# EAGLE schematic oresat-imu (EAGLE 6.6.0)
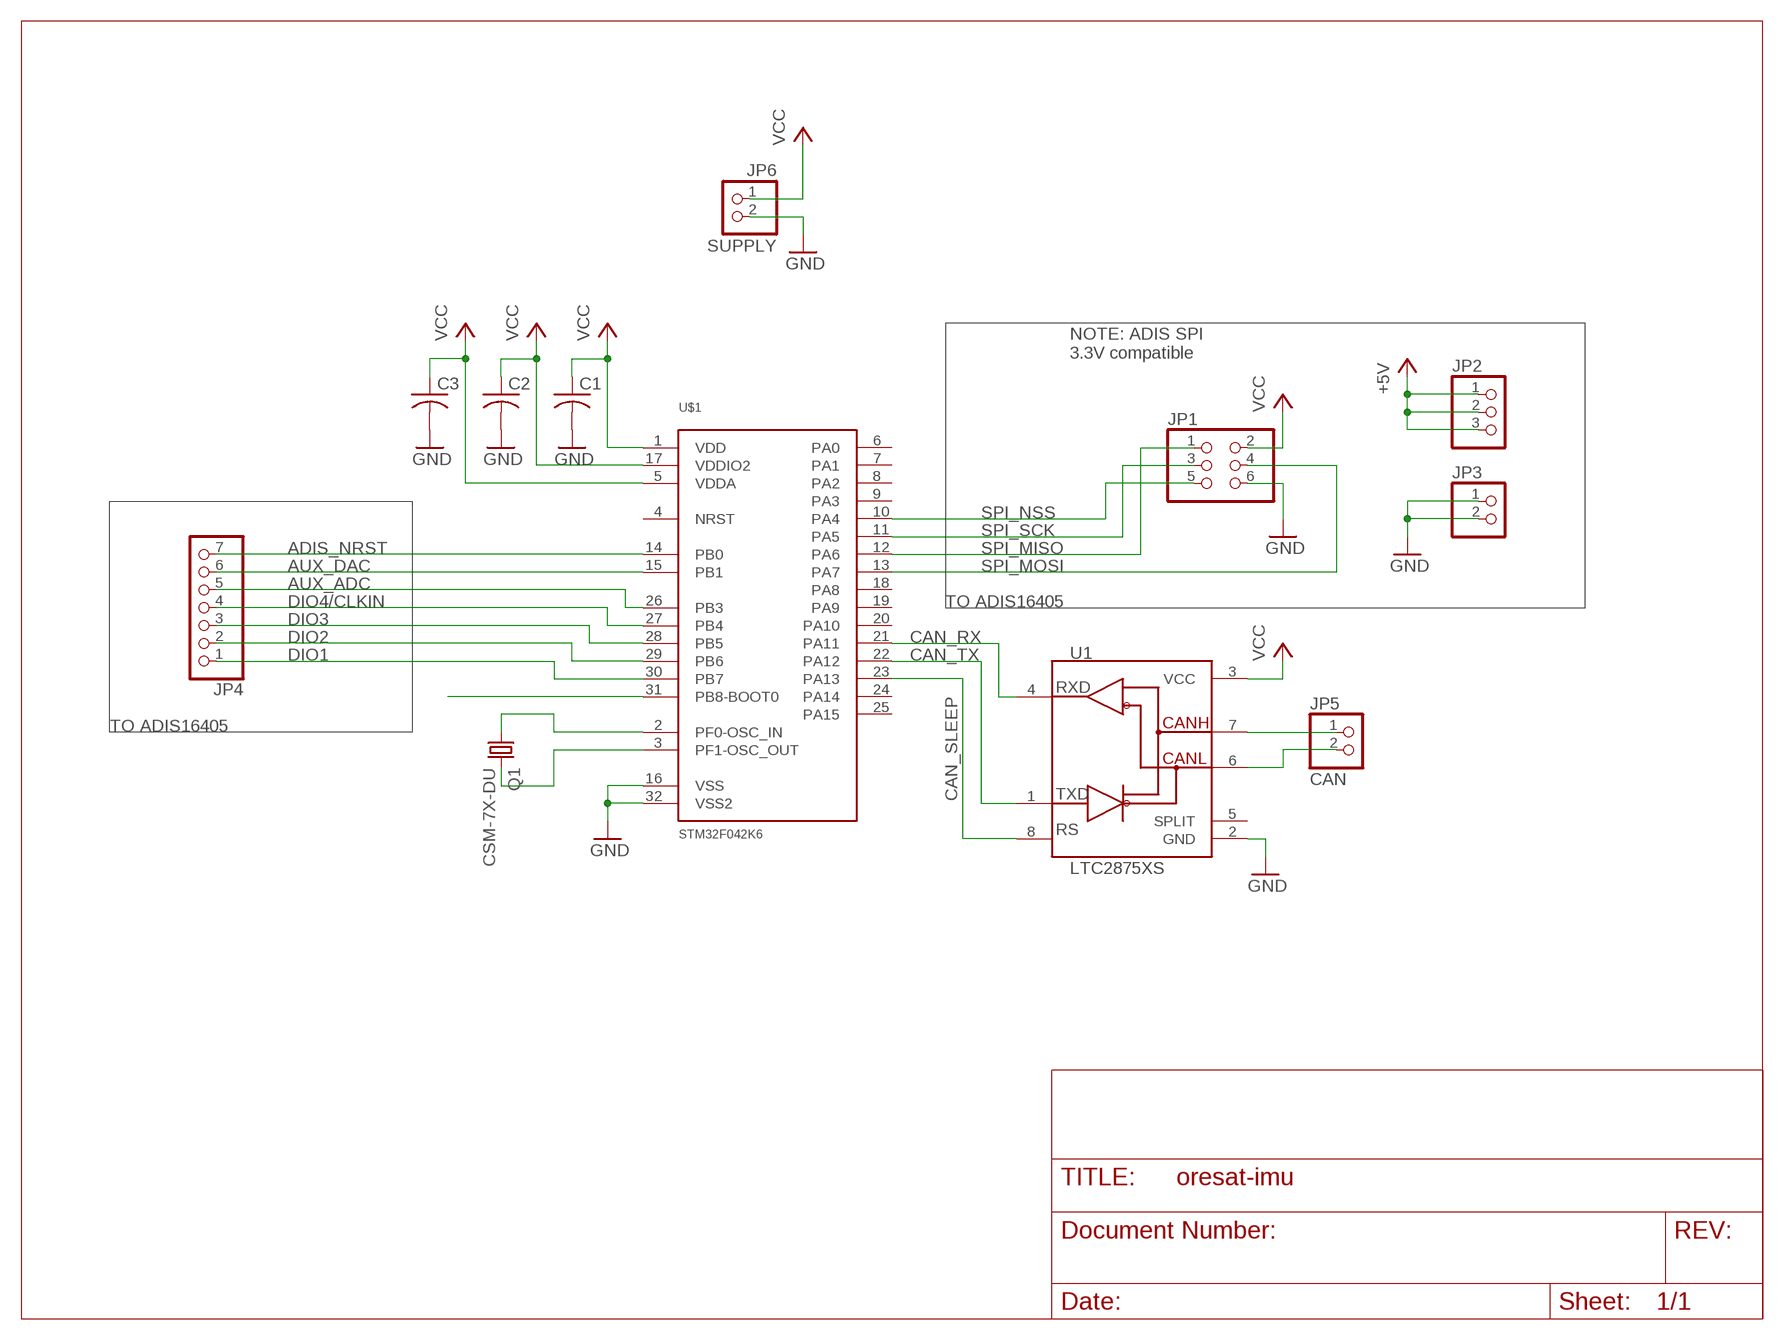
[diagram p0: schematic, sheet 1]

## Parts
C1  C-USC0805  [C0805]
C2  C-USC0805  [C0805]
C3  C-USC0805  [C0805]
JP1  PINHD-2X3  [2X03]
JP2  PINHD-1X3  [1X03]
JP3  PINHD-1X2  [1X02]
JP4  PINHD-1X7  [1X07]
JP5  CAN  PINHD-1X2  [1X02]
JP6  SUPPLY  PINHD-1X2/90  [1X02/90]
Q1  CSM-7X-DU  [CSM-7X-DU]
U1  LTC2875XS  [SO-08]
U$1  STM32F042K6  [LQFP32-7X7]

## Nets
+5V: JP2.1 JP2.2 JP2.3
ADIS_NRST: JP4.7 U$1.14(PB0)
AUX_ADC: JP4.5 U$1.26(PB3)
AUX_DAC: JP4.6 U$1.15(PB1)
CAN_RX: U1.4(RXD) U$1.21(PA11)
CAN_SLEEP: U1.8(RS1) U$1.23(PA13)
CAN_TX: U1.1(TXD) U$1.22(PA12)
CANH: JP5.1 U1.7(CANH)
CANL: JP5.2 U1.6(CANL)
DIO1: JP4.1 U$1.30(PB7)
DIO2: JP4.2 U$1.29(PB6)
DIO3: JP4.3 U$1.28(PB5)
DIO4/CLKIN: JP4.4 U$1.27(PB4)
GND: C1.2 C2.2 C3.2 JP1.6 JP3.1 JP3.2 JP6.2 U1.2(GND) U$1.16(VSS) U$1.32(VSS2)
N$8: Q1.1 U$1.2(PF0-OSC_IN)
N$9: Q1.2 U$1.3(PF1-OSC_OUT)
N$10: U$1.31(PB8-BOOT0)
SPI_MISO: JP1.1 U$1.12(PA6)
SPI_MOSI: JP1.4 U$1.13(PA7)
SPI_NSS: JP1.5 U$1.10(PA4)
SPI_SCK: JP1.3 U$1.11(PA5)
VCC: C1.1 C2.1 C3.1 JP1.2 JP6.1 U1.3(VCC) U$1.1(VDD) U$1.5(VDDA) U$1.17(VDDIO2)
Unconnected: U1.5(SPLIT) U$1.4(NRST) U$1.6(PA0) U$1.7(PA1) U$1.8(PA2) U$1.9(PA3) U$1.18(PA8) U$1.19(PA9) U$1.20(PA10) U$1.24(PA14) U$1.25(PA15)

## Notes on the sheet
- NOTE: ADIS SPI 
  3.3V compatible
- TO ADIS16405
- TO ADIS16405

## Library data of the parts
C1-C3 = rcl:C-US: CAPACITOR, American symbol
JP1 = pinhead:PINHD-2X3: PIN HEADER
JP2 = pinhead:PINHD-1X3: PIN HEADER
JP3 JP5 JP6 = pinhead:PINHD-1X2: PIN HEADER
JP4 = pinhead:PINHD-1X7: PIN HEADER
Q1 = crystal:CSM-7X-DU: SMD CRYSTAL Source: www.ecsxtal.com .. Crystal 3.6864MHz CSM_7X_DU.PDF; OC_FARNELL: unknown; OC_NEWARK: unknown
U1 = borkedlabs-transceivers:LTC2875: 3.3V/5V CAN Transceiver
U$1 = evan:STM32F042K6